# EAGLE schematic schematic (EAGLE 8.6.0)

## Sheet 1 of 3: BIG PCB with NRF52832_QFAA.lbr

## Sheet 2 of 3: BIG PCB with NRF52832-CIAA-R
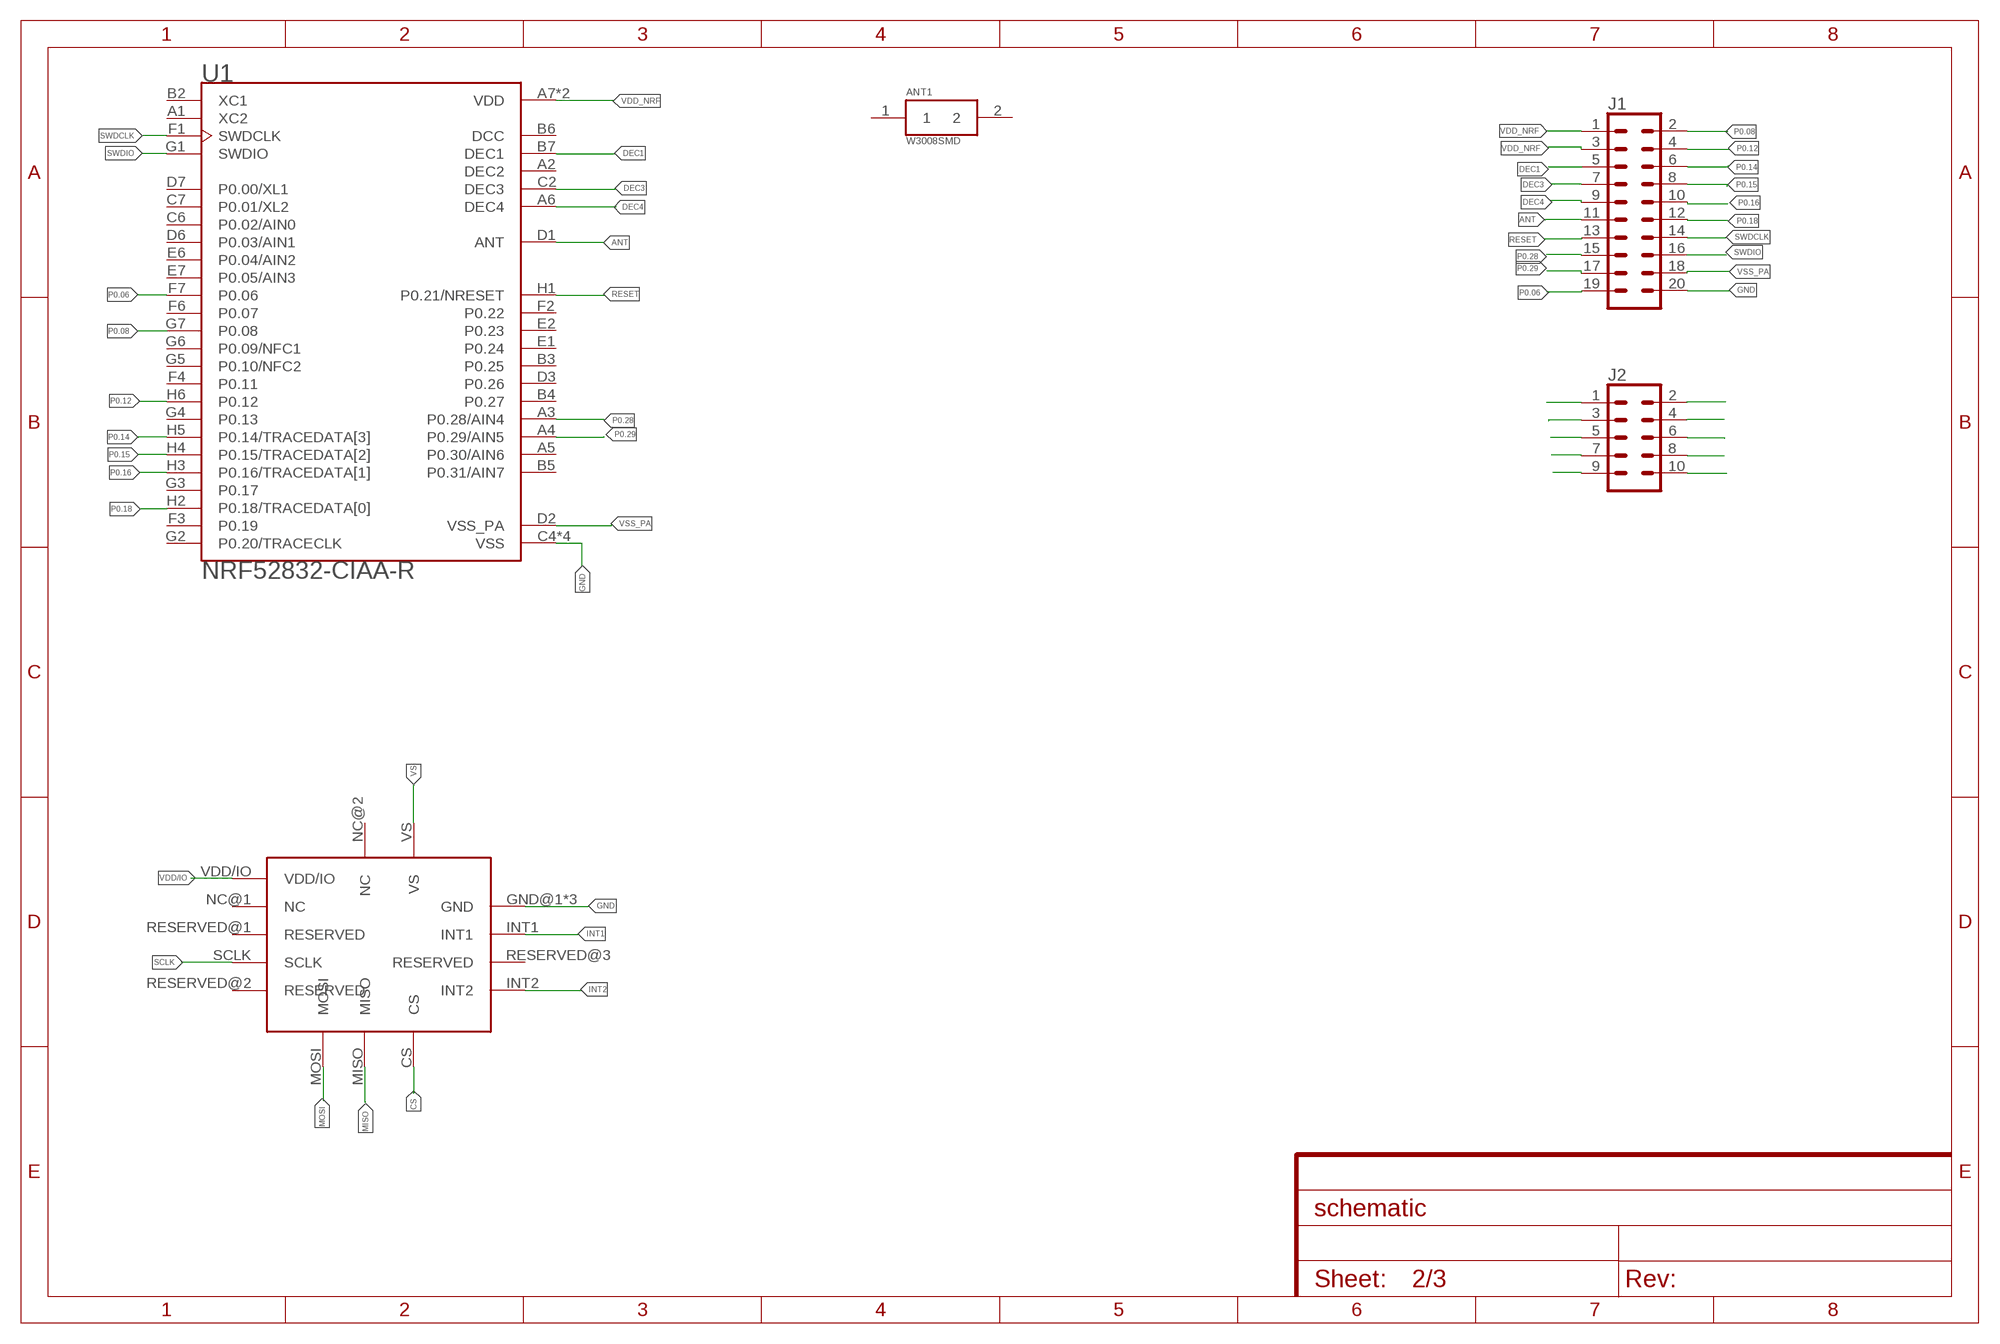
[diagram p0: schematic, sheet 2]

### Parts
ANT1  W3008SMD  [_W3008]
J1  CONN_10X2  [2X10]
J2  CONN_05X20.05_IN_PTH_SILK  [2X5_PTH_SILK_.05]
U1  NRF52832-CIAA-R  [BGA50N40P7X8_300X320X40]
U$1  ADXL362  [TFLGA-16/3.3MMX3.1MM]

### Nets
ANT: J1.11 U1.D1(ANT)
CS: U$1.CS
DEC1: J1.5 U1.B7(DEC1)
DEC3: J1.7 U1.C2(DEC3)
DEC4: J1.9 U1.A6(DEC4)
GND: J1.20 U1.C4(VSS) U1.C5(VSS) U1.E3(VSS) U1.F5(VSS) U$1.GND@1(GND) U$1.GND@2(GND) U$1.GND@3(GND)
INT1: U$1.INT1
INT2: U$1.INT2
MISO: U$1.MISO
MOSI: U$1.MOSI
N$1: J2.1
N$2: J2.3
N$3: J2.5
N$4: J2.7
N$5: J2.9
N$6: J2.2
N$7: J2.4
N$8: J2.6
N$9: J2.8
N$10: J2.10
P0.06: J1.19 U1.F7(P0.06)
P0.08: J1.2 U1.G7(P0.08)
P0.12: J1.4 U1.H6(P0.12)
P0.14: J1.6 U1.H5(P0.14/TRACEDATA[3])
P0.15: J1.8 U1.H4(P0.15/TRACEDATA[2])
P0.16: J1.10 U1.H3(P0.16/TRACEDATA[1])
P0.18: J1.12 U1.H2(P0.18/TRACEDATA[0])
P0.28: J1.15 U1.A3(P0.28/AIN4)
P0.29: J1.17 U1.A4(P0.29/AIN5)
RESET: J1.13 U1.H1(P0.21/NRESET)
SCLK: U$1.SCLK
SWDCLK: J1.14 U1.F1(SWDCLK)
SWDIO: J1.16 U1.G1(SWDIO)
VDD/IO: U$1.VDD/IO
VDD_NRF: J1.1 J1.3 U1.A7(VDD) U1.H7(VDD)
VS: U$1.VS
VSS_PA: J1.18 U1.D2(VSS_PA)
Unconnected: ANT1.1 ANT1.2 U1.A1(XC2) U1.A5(P0.30/AIN6) U1.B2(XC1) U1.B3(P0.25) U1.B4(P0.27) U1.B5(P0.31/AIN7) U1.C6(P0.02/AIN0) U1.C7(P0.01/XL2) U1.D3(P0.26) U1.D6(P0.03/AIN1) U1.D7(P0.00/XL1) U1.E1(P0.24) U1.E2(P0.23) U1.E6(P0.04/AIN2) U1.E7(P0.05/AIN3) U1.F2(P0.22) U1.F3(P0.19) U1.F4(P0.11) U1.F6(P0.07) U1.G2(P0.20/TRACECLK) U1.G3(P0.17) U1.G4(P0.13) U1.G5(P0.10/NFC2) U1.G6(P0.09/NFC1) U$1.NC@1(NC) U$1.NC@2(NC) U$1.RESERVED@1(RESERVED) U$1.RESERVED@2(RESERVED) U$1.RESERVED@3(RESERVED)

## Sheet 3 of 3: SMALL PCB

## Power pins joined to a net without a drawn wire
DCC: U1.B6(DCC)
DEC2: U1.A2(DEC2)

## Library data of the parts
ANT1 = W3008:W3008; AVAILABILITY: Good; DESCRIPTION: ANTENNA BLUETOOTH/WLAN/WIFI CER; MF: Pulse; MP: W3008; PACKAGE: None; PRICE: 0.93 USD
J1 = SparkFun-Connectors:CONN_10X2: Multi connection point. Often used as Generic Header-pin footprint for 0.1 inch spaced/style header connections On any of the 0.1 inch spaced packages, you can populate with these: Break Away Headers - Straight <https://www.sparkfun.com/products/116> (PRT-00116) Break Away Male Headers - Right Angle <https://www.sparkfun.com/products/553> (PRT-00553) Female Headers <https://www.sparkfun.com/products/115> (PRT-00115) Break Away Headers - Machine Pin <https://www.sparkfun.com/products/117> (PRT-00117) Break Away Female Headers - Swiss Machine Pin <https://www.sparkfun.com/products/743> (PRT-00743) Special note about the "SPECIAL" package: This was SPECIALLY designed to be used with our Graphic LCD Backpack. Be sure you want to use this! It is not only staggered on each line of header holes, but IT IS ALSO offset of the center point of the top and bottom lines by 5 mil. This causes the headers to lock into place on the "standard" footprint on the LCD screen. The extra squares on the tdocu layer are there simply to reference other pins (if you were to actually populate a longer header than ten long - this is what we do with the backpacks).
J2 = SparkFun-Connectors:CONN_05X2: Multi connection point. Often used as Generic Header-pin footprint for 0.1 inch spaced/style header connections For AVR SPI programming port, see special device with nice symbol: "AVR_SPI_PROG_5x2.dev" You can populate with any combo of single row headers, but if you'd like an exact match, check these: 2x5 AVR ICSP Male Header <https://www.sparkfun.com/products/778> (PRT-00778) 2x5 Pin Shrouded Header <https://www.sparkfun.com/products/8506> (PRT-08506) On any of the 0.1 inch spaced packages, you can populate with these: Break Away Headers - Straight <https://www.sparkfun.com/products/116> (PRT-00116) Break Away Male Headers - Right Angle <https://www.sparkfun.com/products/553> (PRT-00553) Female Headers <https://www.sparkfun.com/products/115> (PRT-00115) Break Away Headers - Machine Pin <https://www.sparkfun.com/products/117> (PRT-00117) Break Away Female Headers - Swiss Machine Pin <https://www.sparkfun.com/products/743> (PRT-00743) Special note: the shrouded connector mates well with our 5x2 ribbon cables: 2x5 Pin IDC Ribbon Cable <https://www.sparkfun.com/products/8535> (PRT-08535)
U1 = NRF52832-CIAA-R:NRF52832-CIAA-R: Multi Protocal Bluetooth Smart ANT 2.4GHz RF SoC (WL-CSP); AVAILABILITY: Good; DESCRIPTION: IC RF TXRX+MCU BLUETOOTH 50WLCSP; MF: Nordic; MP: NRF52832-CIAA-R; PACKAGE: XFBGA-50 Nordic Semiconductor; PRICE: 3.87 USD
U$1 = ADXL362:ADXL362